# EAGLE design hello (EAGLE 7.2.0)
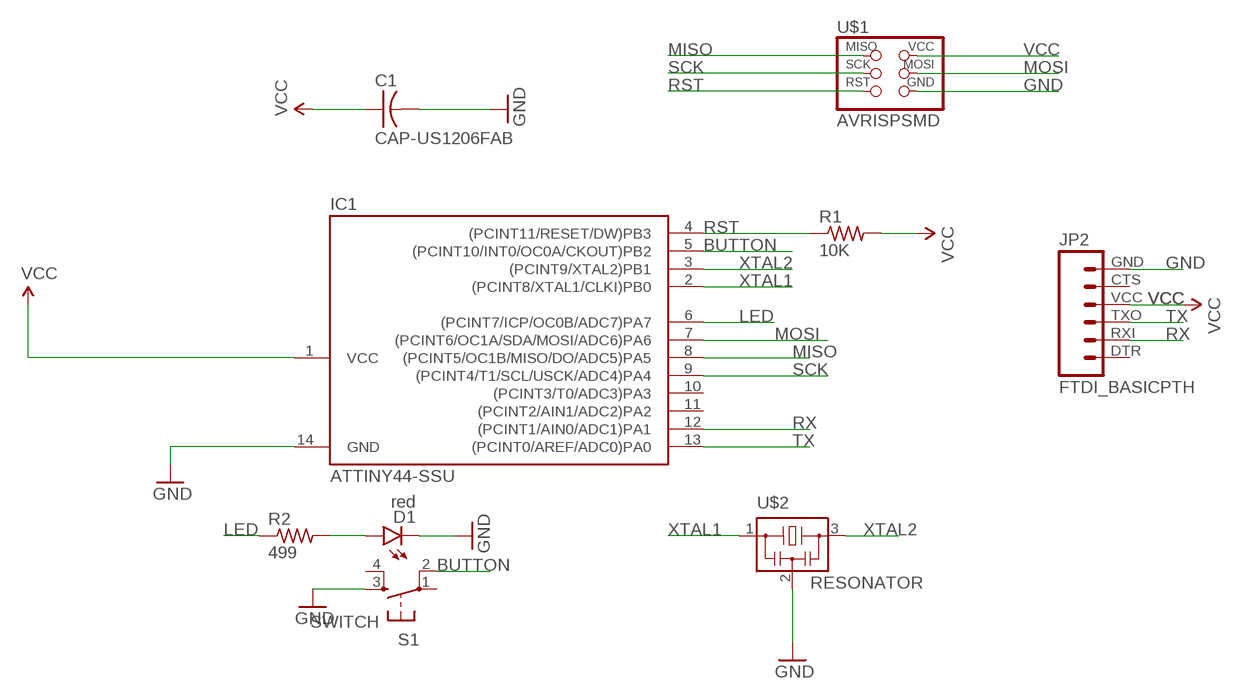
[diagram p0: schematic, sheet 1]

## Parts
C1  CAP-US1206FAB  [C1206FAB]
D1  red  LED1206  [LED-1206]
IC1  ATTINY44-SSU  [SOIC14]
JP2  FTDI_BASICPTH  [FTDI_BASIC]
R1  10K  RES-US1206W  [R1206W]
R2  499  RES-US1206W  [R1206W]
S1  SWITCH  6MM_SWITCH6MM_SWITCH  [6MM_SWITCH]
U$1  AVRISPSMD  [2X03SMD]
U$2  RESONATOR  [EFOBM]

## Nets
BUTTON: IC1.5((PCINT10/INT0/OC0A/CKOUT)PB2) S1.2(P1)
GND: C1.2 D1.C IC1.14(GND) JP2.GND S1.3(S) U$1.6(GND) U$2.2
LED: IC1.6((PCINT7/ICP/OC0B/ADC7)PA7) R2.1
MISO: IC1.8((PCINT5/OC1B/MISO/DO/ADC5)PA5) U$1.1(MISO)
MOSI: IC1.7((PCINT6/OC1A/SDA/MOSI/ADC6)PA6) U$1.4(MOSI)
N$1: D1.A R2.2
RST: IC1.4((PCINT11/RESET/DW)PB3) R1.1 U$1.5(RST)
RX: IC1.12((PCINT1/AIN0/ADC1)PA1) JP2.RXI
SCK: IC1.9((PCINT4/T1/SCL/USCK/ADC4)PA4) U$1.3(SCK)
TX: IC1.13((PCINT0/AREF/ADC0)PA0) JP2.TXO
VCC: C1.1 IC1.1(VCC) JP2.VCC R1.2 U$1.2(VCC)
XTAL1: IC1.2((PCINT8/XTAL1/CLKI)PB0) U$2.1
XTAL2: IC1.3((PCINT9/XTAL2)PB1) U$2.3
Unconnected: IC1.10((PCINT3/T0/ADC3)PA3) IC1.11((PCINT2/AIN1/ADC2)PA2) JP2.CTS JP2.DTR S1.1(P) S1.4(S1)

## Library data of the parts
C1 = fab:CAP-US
D1 = SparkFun-LED:LED: LEDs Standard schematic elements and footprints for 5mm, 3mm, 1206, and 0603 sized LEDs. 5mm - Spark Fun Electronics SKU : COM-00529 (and others)
IC1 = fab:ATTINY44
JP2 = SparkFun-Connectors:FTDI_BASIC: FTDI Basic header with labels
R1 R2 = fab:RES-US: Resistor (US Symbol) Variants with postfix FAB are widened to allow the routing of internal traces
S1 = fab:6MM_SWITCH: OMRON SWITCH
U$1 = fab:AVRISP
U$2 = fab:RESONATOR

## Board
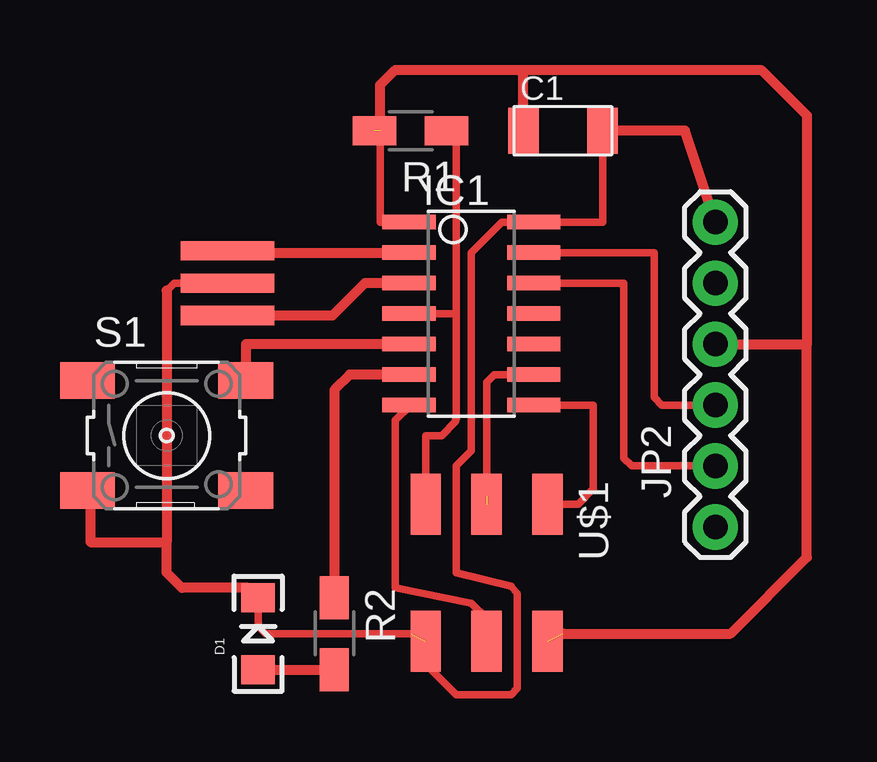
[diagram p1: board, top side]

No outline drawn. Coordinates in mm, seen from the top.
Copper layers (1*16): Top 0.035mm / dielectric 1.5mm / Bottom 0.035mm
Design rules "default": minimum track width 10mil, minimum drill 24mil, track to track 8mil, track to pad 8mil, pad to pad 8mil, via to via 8mil, smd to smd 8mil, copper to edge 40mil, drill to drill 8mil, minimum pad ring 10mil, minimum via ring 8mil, stop-mask expansion 4mil, vias tented up to drill 0mil, thermal gap 10mil

### Footprints (pad centres in the part's own frame; a part is rotated, then mirrored left to right if it is on the bottom)
C1206FAB = smd 1.27 x 1.905: 1 -1.651,0; 2 1.651,0
LED-1206 = smd 1.2 x 1.4: A -1.5,0; C 1.5,0
SOIC14 = smd 0.61 x 2.21: 1 -3.81,-2.603; 2 -2.54,-2.603; 3 -1.27,-2.603; 4 0,-2.603; 5 1.27,-2.603; 6 2.54,-2.603; 7 3.81,-2.603; 8 3.81,2.603; 9 2.54,2.603; 10 1.27,2.603; 11 0,2.603; 12 -1.27,2.603; 13 -2.54,2.603; 14 -3.81,2.603
FTDI_BASIC = drill 1.016 pad 1.88: CTS 10.16,0; DTR 0,0; GND 12.7,0; RXI 2.54,0; TXO 5.08,0; VCC 7.62,0
R1206W = smd 1.8 x 1.2: 1 -1.499,0; 2 1.499,0
6MM_SWITCH = smd 2.286 x 1.524: 1 -3.302,2.286; 2 3.302,2.286; 3 -3.302,-2.286; 4 3.302,-2.286
2X03SMD = smd 2.54 x 1.27: 1 -2.857,2.54; 2 2.857,2.54; 3 -2.857,0; 4 2.857,0; 5 -2.857,-2.54; 6 2.857,-2.54
EFOBM = smd 0.8 x 3.9: 1 -1.35,0; 2 0,0; 3 1.35,0

### Placement (x,y rotation side)
C1  80.01,69.85 0 top
D1  67.31,48.9 90 top
IC1  76.2,62.23 270 top
JP2  86.36,53.34 90 top
R1  73.66,69.85 180 top
R2  70.48,48.9 270 top
S1  63.5,57.15 0 top
U$1  76.83,51.44 270 top
U$2  66.04,63.5 270 top

### Tracks (layer width: path | path; a pad name or v marks a point on that pad's centre or on a via)
BUTTON
  Top 0.406: IC1.5 66.8,60.96 S1.2
GND  (1 unrouted)
  Top 0.305: C1.2 81.66,66.04 IC1.14 77.47,66.04 76.2,64.77 76.2,56.52 75.56,55.88 75.56,51.44 77.86,50.86 78.11,50.55 78.11,46.61 77.85,46.35 75.56,46.35 74.3,47.62 | U$2.2 63.82,63.5 63.5,63.18 | D1.C 67.31,49.21 67.63,48.9 73.66,48.9
  Top 0.406: JP2.GND 85.09,69.85 C1.2 | 63.5,63.18 63.5,52.7 | S1.3 60.33,54.74 60.33,52.7 63.5,52.7 | 63.5,52.7 63.5,51.44 64.14,50.8 66.91,50.8 D1.C | U$1.6 74.3,47.62
LED
  Top 0.406: IC1.6 71.12,59.69 70.48,59.05 R2.1
MISO
  Top 0.305: IC1.8 81.28,58.42 81.28,54.93 80.64,54.29 U$1.1
MOSI
  Top 0.305: U$1.4 76.83,49.53 76.2,50.16 73.03,50.8 73.03,57.78 73.66,58.42 IC1.7
N$1
  Top 0.406: D1.A R2.2
RST
  Top 0.305: 75.56,69.44 75.56,69.85 | 75.56,62.23 75.56,57.86 75.53,57.72 74.96,57.15 74.3,57.15 U$1.5 | 75.56,62.23 75.56,69.44 | R1.1 75.56,69.44 | IC1.4 75.56,62.23
RX
  Top 0.305: JP2.RXI 82.87,55.88 82.55,56.2 82.55,63.5 IC1.12
SCK  (1 unrouted)
  Top 0.305: IC1.9 77.15,59.69 76.83,59.37 76.83,54.61
TX
  Top 0.305: JP2.TXO 84.14,58.42 83.82,58.74 83.82,64.77 IC1.13
VCC  (2 unrouted)
  Top 0.305: 72.39,69.85 72.39,66.04 IC1.1
  Top 0.406: 72.39,69.85 72.39,71.75 73.03,72.39 78.36,72.39 | C1.1 78.36,72.39 | JP2.VCC 90.17,60.96 | 78.36,72.39 88.27,72.39 90.17,70.48 90.17,60.96 | 80.01,48.9 87,48.9 90.17,52.07 90.17,60.96
XTAL1
  Top 0.305: U$2.1 66.12,64.77
  Top 0.406: 66.12,64.77 IC1.2
XTAL2
  Top 0.406: IC1.3 71.75,63.5 70.41,62.15 U$2.3